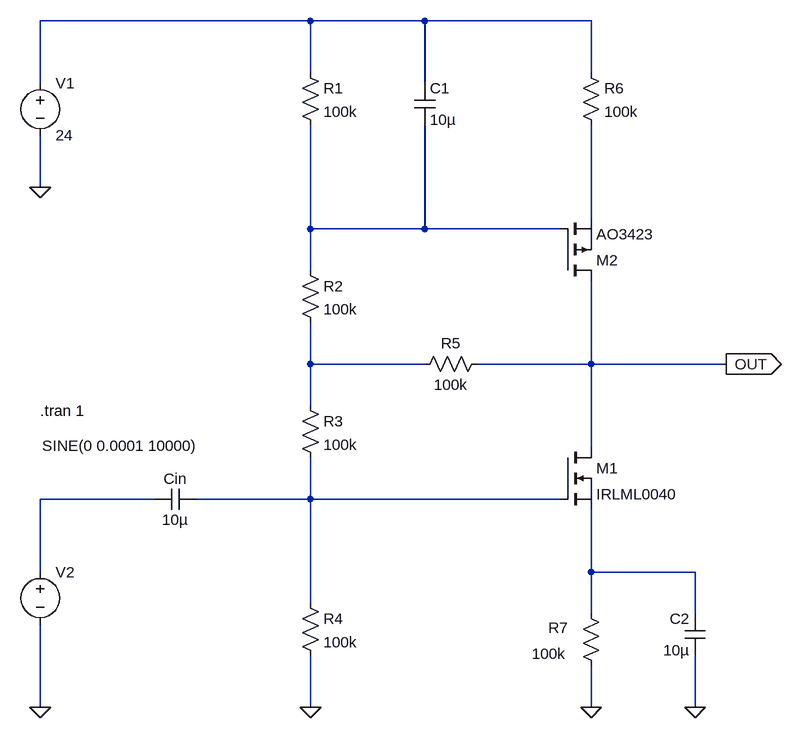
[diagram p0: schematic analog_amp_fet.asc]
analog_amp_fet.asc, the LTspice schematic file:
Version 4
SHEET 1 1708 756
WIRE 208 -416 -208 -416
WIRE 384 -416 208 -416
WIRE 640 -416 384 -416
WIRE 208 -336 208 -416
WIRE 640 -336 640 -416
WIRE -208 -320 -208 -416
WIRE 384 -320 384 -416
WIRE -208 -160 -208 -240
WIRE 640 -112 640 -256
WIRE 208 -96 208 -256
WIRE 384 -96 384 -256
WIRE 384 -96 208 -96
WIRE 592 -96 384 -96
WIRE 208 -32 208 -96
WIRE 208 112 208 48
WIRE 384 112 208 112
WIRE 640 112 640 -16
WIRE 640 112 464 112
WIRE 848 112 640 112
WIRE 208 176 208 112
WIRE 640 240 640 112
WIRE -32 320 -208 320
WIRE 208 320 208 256
WIRE 208 320 32 320
WIRE 592 320 208 320
WIRE -208 432 -208 320
WIRE 640 432 640 336
WIRE 800 432 640 432
WIRE 208 480 208 320
WIRE 640 496 640 432
WIRE 800 496 800 432
WIRE -208 640 -208 512
WIRE 208 640 208 560
WIRE 640 640 640 576
WIRE 800 640 800 560
FLAG 640 640 0
FLAG -208 640 0
FLAG -208 -160 0
FLAG 208 640 0
FLAG 800 640 0
FLAG 848 112 OUT
IOPIN 848 112 Out
SYMBOL res 624 -352 R0
SYMATTR InstName R6
SYMATTR Value 100k
SYMBOL res 624 480 R0
WINDOW 0 -50 38 Left 2
WINDOW 3 -75 78 Left 2
SYMATTR InstName R7
SYMATTR Value 100k
SYMBOL voltage -208 -336 R0
WINDOW 123 0 0 Left 0
WINDOW 39 0 0 Left 0
SYMATTR InstName V1
SYMATTR Value 24
SYMBOL voltage -208 416 R0
WINDOW 123 0 0 Left 0
WINDOW 39 0 0 Left 0
WINDOW 3 3 -178 Left 2
SYMATTR InstName V2
SYMATTR Value SINE(0 0.0001 10000)
SYMBOL cap 32 304 R90
WINDOW 0 0 32 VBottom 2
WINDOW 3 32 32 VTop 2
SYMATTR InstName Cin
SYMATTR Value 10µ
SYMBOL cap 816 560 R180
WINDOW 0 24 56 Left 2
WINDOW 3 24 8 Left 2
SYMATTR InstName C2
SYMATTR Value 10µ
SYMBOL res 192 -352 R0
SYMATTR InstName R1
SYMATTR Value 100k
SYMBOL res 192 -48 R0
SYMATTR InstName R2
SYMATTR Value 100k
SYMBOL res 192 464 R0
SYMATTR InstName R4
SYMATTR Value 100k
SYMBOL res 480 96 R90
WINDOW 0 0 56 VBottom 2
WINDOW 3 32 56 VTop 2
SYMATTR InstName R5
SYMATTR Value 100k
SYMBOL res 192 160 R0
SYMATTR InstName R3
SYMATTR Value 100k
SYMBOL cap 368 -320 R0
SYMATTR InstName C1
SYMATTR Value 10µ
SYMBOL nmos 592 240 R0
SYMATTR InstName M1
SYMATTR Value IRLML0040
SYMBOL pmos 592 -16 M180
SYMATTR InstName M2
SYMATTR Value AO3423
TEXT -208 184 Left 2 !.tran 1

The netlist it stands for:
* analog_amp_fet.asc
R6 N001 N002 100k
R7 N007 0 100k
V1 N001 0 24
V2 N005 0 SINE(0 0.0001 10000)
Cin N006 N005 10µ
C2 0 N007 10µ
R1 N001 N003 100k
R2 N003 N004 100k
R4 N006 0 100k
R5 OUT N004 100k
R3 N004 N006 100k
C1 N001 N003 10µ
M1 OUT N006 N007 N007 IRLML0040
M2 OUT N003 N002 N002 AO3423
.model NMOS NMOS
.model PMOS PMOS
.lib standard.mos
.tran 1
.backanno
.end